# EAGLE schematic PCB-DISPARRAY4b (EAGLE 7.1.0)

## Sheet 1 of 2
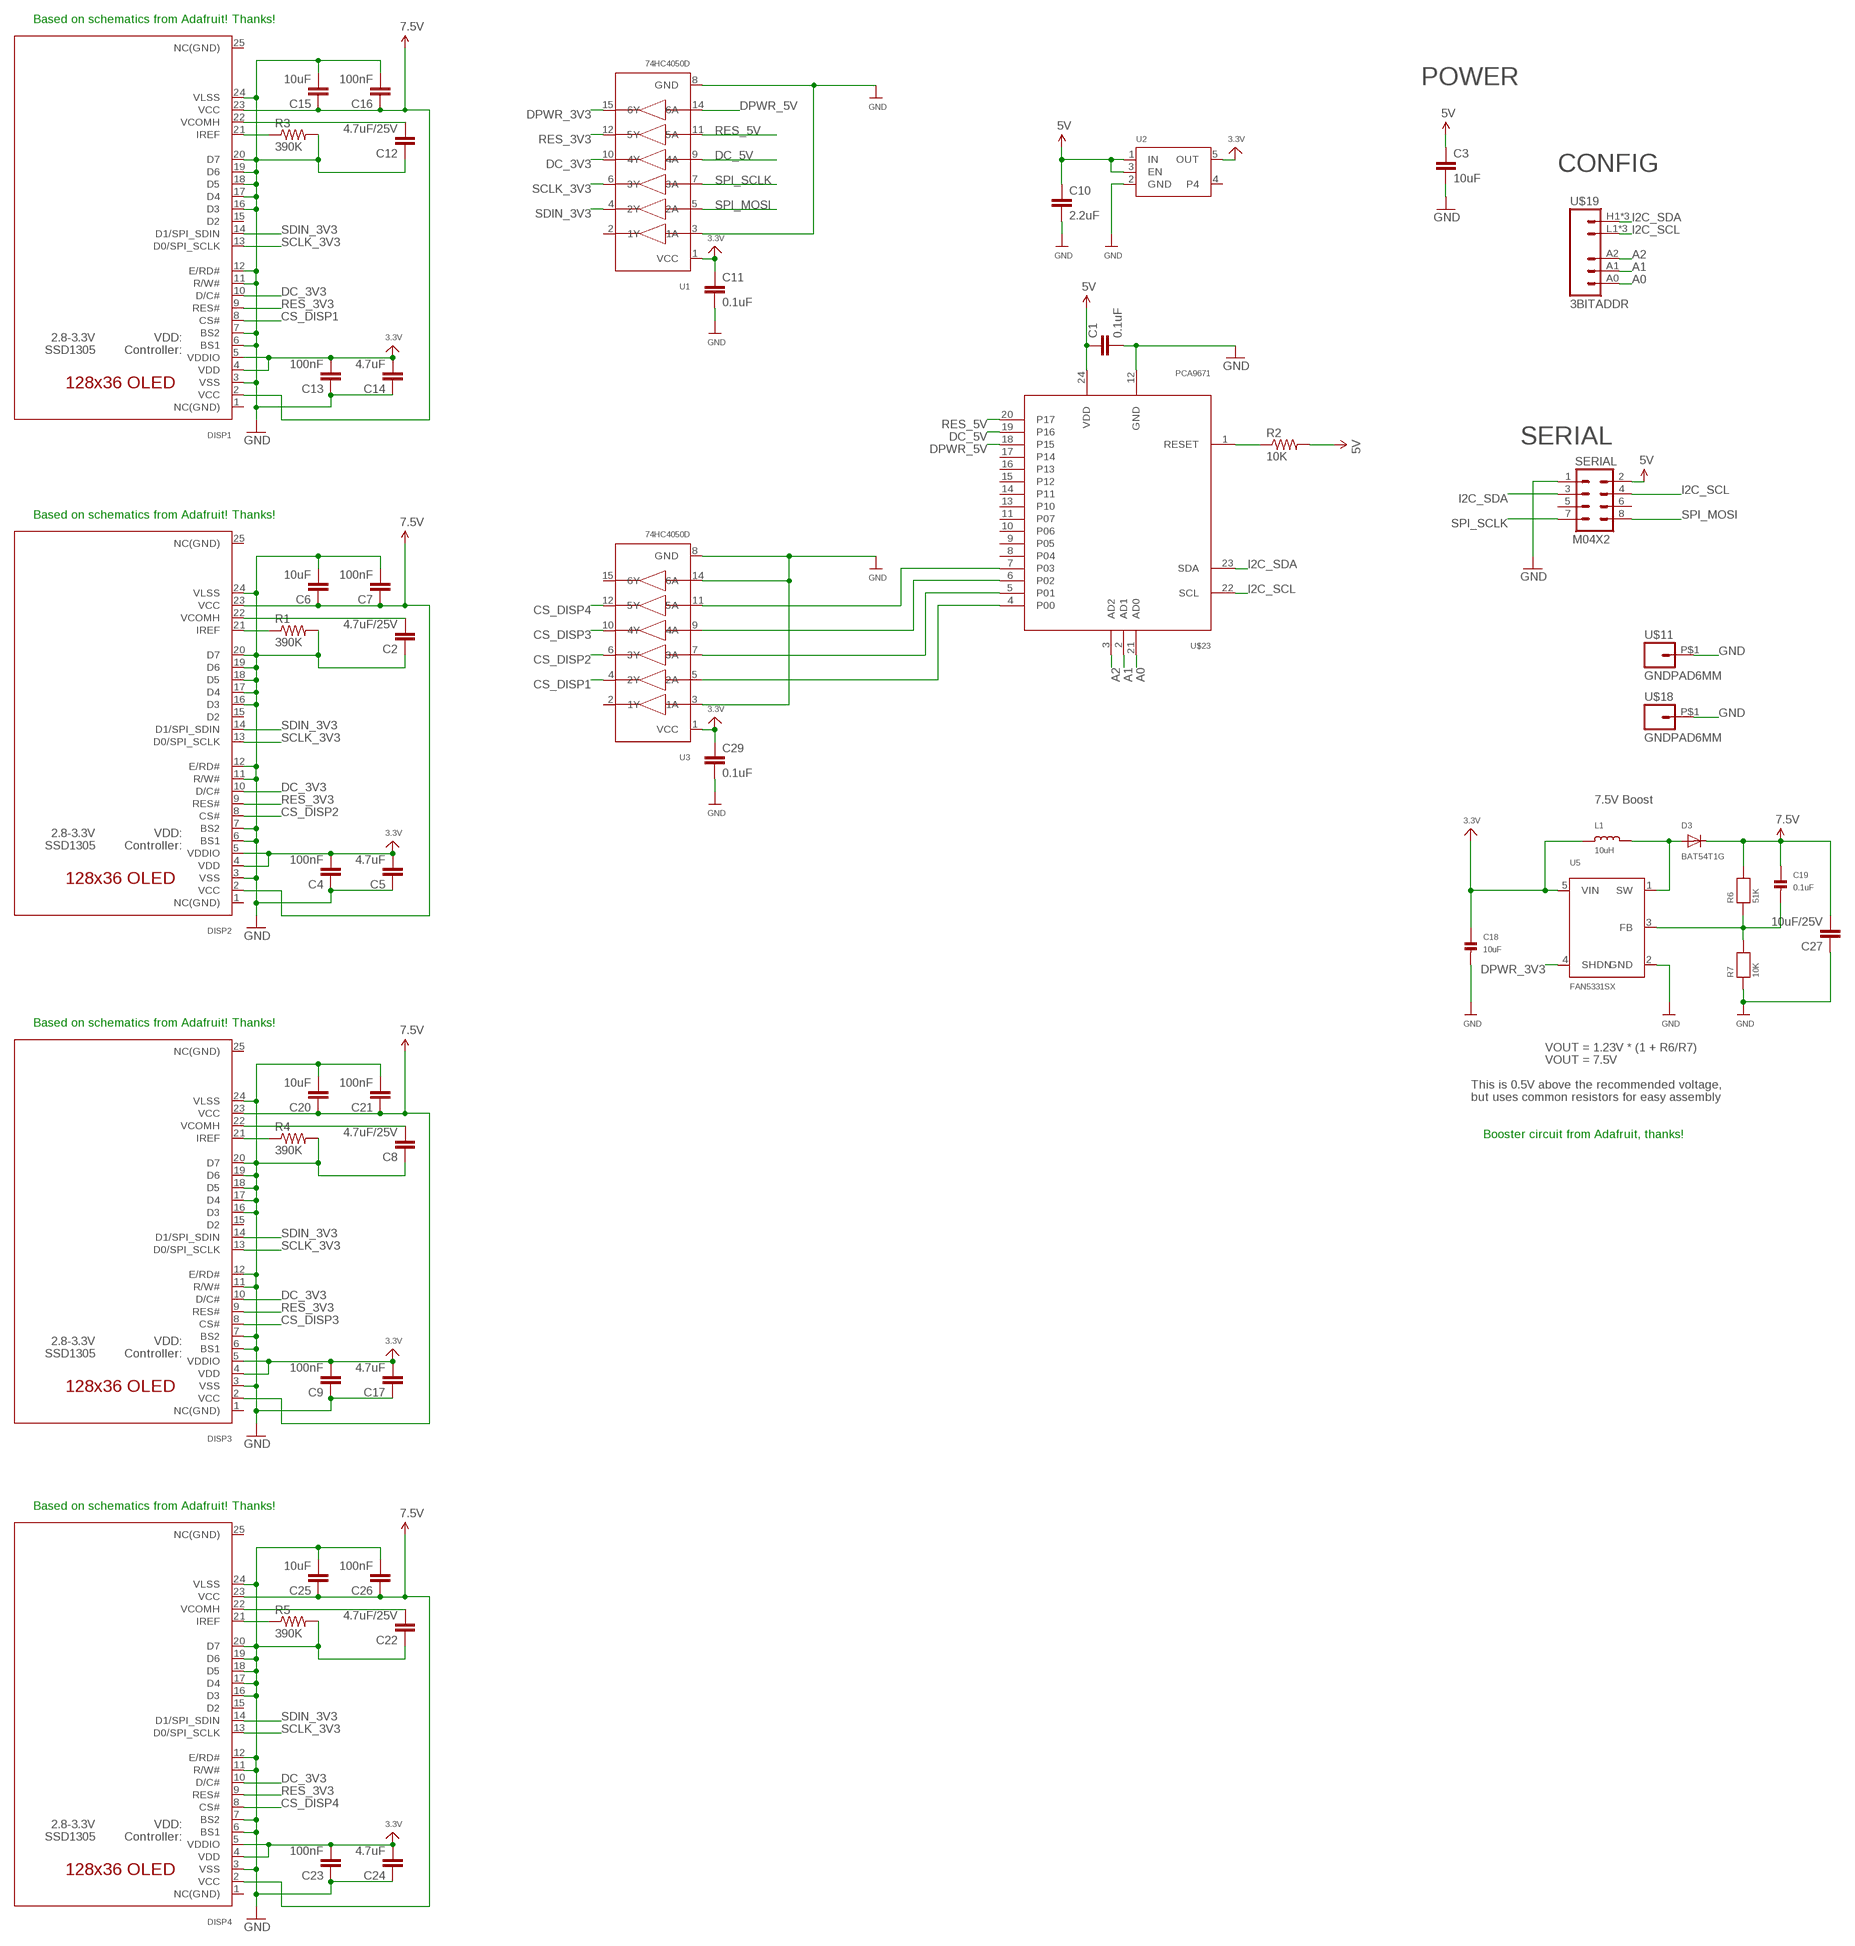
[diagram p0: schematic, sheet 1]

### Parts
C1  0.1uF  CAP0603-CAP  [0603-CAP]
C2  4.7uF/25V  CAP0805  [0805]
C3  10uF  CAP0805  [0805]
C4  100nF  CAP0603-CAP  [0603-CAP]
C5  4.7uF  CAP0603-CAP  [0603-CAP]
C6  10uF  CAP0805  [0805]
C7  100nF  CAP0603-CAP  [0603-CAP]
C8  4.7uF/25V  CAP0805  [0805]
C9  100nF  CAP0603-CAP  [0603-CAP]
C10  2.2uF  CAP0603-CAP  [0603-CAP]
C11  0.1uF  CAP0603-CAP  [0603-CAP]
C12  4.7uF/25V  CAP0805  [0805]
C13  100nF  CAP0603-CAP  [0603-CAP]
C14  4.7uF  CAP0603-CAP  [0603-CAP]
C15  10uF  CAP0805  [0805]
C16  100nF  CAP0603-CAP  [0603-CAP]
C17  4.7uF  CAP0603-CAP  [0603-CAP]
C18  10uF  CAP_CERAMIC0805  [0805]
C19  0.1uF  CAP_CERAMIC0603  [0603]
C20  10uF  CAP0805  [0805]
C21  100nF  CAP0603-CAP  [0603-CAP]
C22  4.7uF/25V  CAP0805  [0805]
C23  100nF  CAP0603-CAP  [0603-CAP]
C24  4.7uF  CAP0603-CAP  [0603-CAP]
C25  10uF  CAP0805  [0805]
C26  100nF  CAP0603-CAP  [0603-CAP]
C27  10uF/25V  CAP0805  [0805]
C29  0.1uF  CAP0603-CAP  [0603-CAP]
D3  BAT54T1G  DIODESOD-123  [SOD-123]
DISP1  ER-OLED011-1TOP  [ER-OLED011-1]
DISP2  ER-OLED011-1TOP  [ER-OLED011-1]
DISP3  ER-OLED011-1TOP  [ER-OLED011-1]
DISP4  ER-OLED011-1TOP  [ER-OLED011-1]
L1  10uH  INDUCTOR  [INDUCTOR_1007]
R1  390K  RESISTOR0603-RES  [0603-RES]
R2  10K  RESISTOR0603-RES  [0603-RES]
R3  390K  RESISTOR0603-RES  [0603-RES]
R4  390K  RESISTOR0603-RES  [0603-RES]
R5  390K  RESISTOR0603-RES  [0603-RES]
R6  51K  RESISTOR0603  [0603]
R7  10K  RESISTOR0603  [0603]
SERIAL  M04X2  [2X4]
U1  74HC4050D  74HC4050DTSSOP16  [TSSOP16]
U2  VREG_SOT23-5  [SOT23-5]
U3  74HC4050D  74HC4050DTSSOP16  [TSSOP16]
U5  FAN5331SX  FAN5331  [SOT23-5]
U$11  GNDPAD6MM  [3.2MMPAD6MM]
U$18  GNDPAD6MM  [3.2MMPAD6MM]
U$19  3BITADDR  [3BITADDR]
U$23  PCA9671  [TSSOP24]

### Nets
3.3V [Power]: C4.2 C5.2 C9.2 C11.1 C13.2 C14.2 C17.2 C18.1 C23.2 C24.2 C29.1 DISP1.4(VDD) DISP1.5(VDDIO) DISP2.4(VDD) DISP2.5(VDDIO) DISP3.4(VDD) DISP3.5(VDDIO) DISP4.4(VDD) DISP4.5(VDDIO) L1.P$1 U1.1(VCC) U2.5(OUT) U3.1(VCC) U5.5(VIN)
5V [Power]: C1.1 C3.1 C10.1 R2.2 SERIAL.2 U2.1(IN) U2.3(EN) U$23.24(VDD)
7.5V [Power]: C6.1 C7.1 C15.1 C16.1 C19.1 C20.1 C21.1 C25.1 C26.1 C27.2 D3.C DISP1.2(VCC) DISP1.23(VCC) DISP2.2(VCC) DISP2.23(VCC) DISP3.2(VCC) DISP3.23(VCC) DISP4.2(VCC) DISP4.23(VCC) R6.2
A0: U$19.A0 U$23.21(AD0)
A1: U$19.A1 U$23.2(AD1)
A2: U$19.A2 U$23.3(AD2)
CS_DISP1: DISP1.8(CS#) U3.4(2Y)
CS_DISP2: DISP2.8(CS#) U3.6(3Y)
CS_DISP3: DISP3.8(CS#) U3.10(4Y)
CS_DISP4: DISP4.8(CS#) U3.12(5Y)
DC_3V3: DISP1.10(D/C#) DISP2.10(D/C#) DISP3.10(D/C#) DISP4.10(D/C#) U1.10(4Y)
DC_5V: U1.9(4A) U$23.19(P16)
DPWR_3V3: U1.15(6Y) U5.4(SHDN)
DPWR_5V [Power]: U1.14(6A) U$23.18(P15)
GND [Power]: C1.2 C2.1 C3.2 C4.1 C5.1 C6.2 C7.2 C8.1 C9.1 C10.2 C11.2 C12.1 C13.1 C14.1 C15.2 C16.2 C17.1 C18.2 C20.2 C21.2 C22.1 C23.1 C24.1 C25.2 C26.2 C27.1 C29.2 DISP1.3(VSS) DISP1.6(BS1) DISP1.7(BS2) DISP1.11(R/W#) DISP1.12(E/RD#) DISP1.16(D3) DISP1.17(D4) DISP1.18(D5) DISP1.19(D6) DISP1.20(D7) DISP1.24(VLSS) DISP2.3(VSS) DISP2.6(BS1) DISP2.7(BS2) DISP2.11(R/W#) DISP2.12(E/RD#) DISP2.16(D3) DISP2.17(D4) DISP2.18(D5) DISP2.19(D6) DISP2.20(D7) DISP2.24(VLSS) DISP3.3(VSS) DISP3.6(BS1) DISP3.7(BS2) DISP3.11(R/W#) DISP3.12(E/RD#) DISP3.16(D3) DISP3.17(D4) DISP3.18(D5) DISP3.19(D6) DISP3.20(D7) DISP3.24(VLSS) DISP4.3(VSS) DISP4.6(BS1) DISP4.7(BS2) DISP4.11(R/W#) DISP4.12(E/RD#) DISP4.16(D3) DISP4.17(D4) DISP4.18(D5) DISP4.19(D6) DISP4.20(D7) DISP4.24(VLSS) R1.2 R3.2 R4.2 R5.2 R7.1 SERIAL.1 U1.3(1A) U1.8(GND) U2.2(GND) U3.3(1A) U3.8(GND) U3.14(6A) U5.2(GND) U$11.P$1 U$18.P$1 U$23.12(GND)
I2C_SCL: SERIAL.4 U$19.L1(GND) U$19.L2(GND) U$19.L3(GND) U$23.22(SCL)
I2C_SDA: SERIAL.3 U$19.H1(VCC) U$19.H2(VCC) U$19.H3(VCC) U$23.23(SDA)
N$1: R2.1 U$23.1(RESET)
N$2: DISP2.21(IREF) R1.1
N$3: C2.2 DISP2.22(VCOMH)
N$4: DISP3.21(IREF) R4.1
N$5: DISP1.21(IREF) R3.1
N$6: C8.2 DISP3.22(VCOMH)
N$7: DISP4.21(IREF) R5.1
N$8: C22.2 DISP4.22(VCOMH)
N$10: C12.2 DISP1.22(VCOMH)
N$14 [Power]: D3.A L1.P$2 U5.1(SW)
N$15: C19.2 R6.1 R7.2 U5.3(FB)
N$29: U3.5(2A) U$23.4(P00)
N$30: U3.7(3A) U$23.5(P01)
N$31: U3.9(4A) U$23.6(P02)
N$32: U3.11(5A) U$23.7(P03)
RES_3V3: DISP1.9(RES#) DISP2.9(RES#) DISP3.9(RES#) DISP4.9(RES#) U1.12(5Y)
RES_5V: U1.11(5A) U$23.20(P17)
SCLK_3V3: DISP1.13(D0/SPI_SCLK) DISP2.13(D0/SPI_SCLK) DISP3.13(D0/SPI_SCLK) DISP4.13(D0/SPI_SCLK) U1.6(3Y)
SDIN_3V3: DISP1.14(D1/SPI_SDIN) DISP2.14(D1/SPI_SDIN) DISP3.14(D1/SPI_SDIN) DISP4.14(D1/SPI_SDIN) U1.4(2Y)
SPI_MOSI: SERIAL.8 U1.5(2A)
SPI_SCLK: SERIAL.7 U1.7(3A)
Unconnected: DISP1.1(NC(GND)) DISP1.15(D2) DISP1.25(NC(GND)) DISP2.1(NC(GND)) DISP2.15(D2) DISP2.25(NC(GND)) DISP3.1(NC(GND)) DISP3.15(D2) DISP3.25(NC(GND)) DISP4.1(NC(GND)) DISP4.15(D2) DISP4.25(NC(GND)) SERIAL.5 SERIAL.6 U1.2(1Y) U2.4 U3.2(1Y) U3.15(6Y) U$23.8(P04) U$23.9(P05) U$23.10(P06) U$23.11(P07) U$23.13(P10) U$23.14(P11) U$23.15(P12) U$23.16(P13) U$23.17(P14)

### Notes on the sheet
- Based on schematics from Adafruit! Thanks!
- POWER
- CONFIG
- SERIAL
- Based on schematics from Adafruit! Thanks!
- 7.5V Boost
- Based on schematics from Adafruit! Thanks!
- VOUT = 1.23V * (1 + R6/R7)
- VOUT = 7.5V
- This is 0.5V above the recommended voltage,
- but uses common resistors for easy assembly
- Booster circuit from Adafruit, thanks!
- Based on schematics from Adafruit! Thanks!

## Sheet 2 of 2

## Library data of the parts
C1-C17 C20-C27 C29 = SparkFun:CAP: Capacitor Standard 0603 ceramic capacitor, and 0.1" leaded capacitor.
C18 C19 = microbuilder:CAP_CERAMIC: Ceramic Capacitors 0402 - 0402 Surface Mount Capacitors 16pF 50V 5% [Digikey: 445-4899-2-ND] 18pF 50V 5% [Digikey: 490-1281-2-ND] 22pF 50V 5% [Digikey: 490-1283-2-ND] 68pF 50V 5% [Digikey: 490-1289-2-ND] 0.1uF 10V 10% [Digikey: 490-1318-2-ND] 1.0uF 6.3V 10% [Digikey: 490-1320-2-ND] 0603 - 0603 Surface Mount Capacitors 16 pF 50V 5% [Digikey: 445-5051-2-ND] 22 pF 50V [Digikey: PCC220ACVTR-ND] 33 pF 50V 5% [Digikey: 490-1415-1-ND] 56pF 50V 5% [Digikey: 490-1421-1-ND] 220pF 50V 5% [Digikey: 445-1285-1-ND] 680 pF 50V 2200 pF 50V 5% C0G [Digikey: 445-1297-1-ND] 5600 pF 100V 5% X7R [Digikey: 478-3711-1-ND] 0.1 µF 25V 10% [Digikey: PCC2277TR-ND] 0.22 µF 16V 10% X7R [Digikey: 445-1318-1-ND] 1.0 µF 25V 10% [Digikey: 445-5146-2-ND] 0603 - RF Specific 3pF 250V +/-0.1pF RF [Digikey: 712-1347-1-ND] 18 pF 250V 5% [Digikey: 478-3505-1-ND or 712-1322-1-ND] 56 pF 250V 5% C0G RF [Digikey: 490-4867-1-ND] 68 pF 250V RF [Digikey: 490-4868-1-ND] 0805 - 0805 Surface Mount Capacitors 220 pF 250V 2% RF Ceramic Capacitor [Digikey: 712-1398-1-ND] 1000 pF 50V 2% NP0 Ceramic Capacitor [Digikey: 478-3760-1-ND] 0.1 µF 25V 10% Ceramic Capacitor [Digikey: PCC1828TR-ND] 1.0 µF 16V 10% Ceramic Capacitor[Digikey: 490-1691-2-ND] 10.0 µF 10V 10% Ceramic Capacitor[Digikey: 709-1228-1-ND] 10.0 uF 16V 10% Ceramic Capacitor [Digikey: 478-5165-2-ND] 47 uF 6.3V 20% Ceramic Capacitor [Digikey: 587-1779-1-ND or 399-5506-1-ND] 1206 - 1206 Surface Mount Capacitors 47uF 10V 20% Ceramic Capacitor [Digikey: 490-5528-1-ND or 399-5508-1-ND or 445-6010-1-ND] 100uF 6.3V -20%, +80% Y5V Ceramic Capacitor (Digikey: 490-4512-1-ND, Mouser: 81-GRM31CF50J107ZE1L)
D3 = microbuilder:DIODE: Diode SMA Model Volts Amps Type Vf Vr Digikey # Notes SSA34-E3 40V 3A Schottky 480mV @ 3A 200uA @ 40V SSA34-E3/61TGITR-ND CDBA120-G 20V 1A Schottky 500mV @ 1A 500uA @ 20V 641-1014-6-ND REEL MBRA210 10V 2A Schottky 350mV @ 2A 700uA @ 10V MBRA210LT3 SOD-123 Model Volts Amps Type Vf Vr Order # Notes BAT54T1G 30V 200mA Schottky 800mV @ 200mA 2uA @ 25V BAT54T1GOSTR-ND B0530W 30V 500mA Schottky 430mV @ 500mA 130uA @ 30V B0530W-FDICT-ND REEL MBR120 1A 20V Schottky 340mV @ 1A MBR120VLSFT1GOSCT-ND SOD-323 Model Volts Amps Type Vf Vr Order # Notes PMEG2005EJ 20V 500mA Schottky 355mV @ 500mA 568-4110-1-ND ZLLS410 10V 570mA Schottky 380mV @ 570mA ZLLS410CT-ND 1N4148WS 75V 150mA Silicon/Simple 1V 1N4148WSFSCT-ND REEL SOD-523 Model Volts Amps Type Vf Vr Order # Notes BAT54XV2 30V 200mA Schottky 0.8V @ 100mA BAT54XV2CT-ND TB751S 30V 30mA Schottky RB751S-40TE61CT-ND SOT23-R/W (R = Solder Paste/Reflow Ovens, W = Hand-Soldering) Model Volts Amps Type Vf Vr Order # Notes BAT54FILM 40V 300mA Schottky 497-7162-1-ND
DISP1-DISP4 = SKAARHOJ:ER-OLED011-1: UG-2864HSWEG01 OLED display Both 1.3" and 0.96" models share the same FPC tab footprint, only the screen dimensions vary.
L1 = microbuilder:INDUCTOR: Inductors 0603: 10nH Ceramic Inductor - microwire antenna/RF (Digikey: 712-1434-2-ND) 0805: 560nH Ceramic Inductor - RF (Digikey: 553-1047-1-ND) 270nH Ceramic Inductor - Q = 40@250MHz, +-5%, 1 Ohm DC Resistance (Digikey: 535-10506-2-ND) 1007 (2518 Metric) SMT: 10µH 10% 250mOhm 820mA 1007 Inductor (Digikey: 587-2189-1-ND) 22µH 10% 500mOhm 580mA 1007 Inductor (Digikey: 587-2190-1-ND) 47µH 10% 950mOhm 420mA 1007 Inductor (Digikey: 587-2191-1-ND) 47µH 5% 100mOhm 1A 1008 Inductor (Digikey: 732-1816-1-ND) 5.0x5.0mm (Taiyo Yuden NR5040 Series) 6.8µH 20% 2.3A 64mOhm Inductor (Digikey: 587-2374-2-ND) 5.0x5.0mm (TDK VLC5045 Series) 4.7µH 20% 3.3A 34mOhm Inductor (Digikey: 445-6526-1-ND) 6.8µH 20% 2.7A 46mOhm Inductor (Digikey: 445-6527-1-ND) 6.0x6.0mm (TDK VLC6045 Series) 4.7µH 20% 3.8A 27mOhm Inductor (Digikey: 445-6538-2-ND) 6.8µH 20% 3A 41mOhm Inductor (Digikey: 445-6540-1-ND) 6.2µH 30% 2.2A 45mOhm Inductor (Digikey: SRR5028-6R2YCT-ND) - Not TDK VLC6045 but footprint should match 6.0x6.0mm (TDK SLF6045 Series) 6.8uH 30% 2A 33mOhm Inductor (Digikey: 445-4572-1-ND, Mouser: 810-SLF645T6R8N2R0PF)
R1-R5 = SparkFun:RESISTOR: Resistor Basic schematic elements and footprints for 0603, 1206, and PTH resistors.
R6 R7 = microbuilder:RESISTOR: Resistors 0402 - 0402 Surface Mount Package 22 Ohm 1% 1/16W [Digikey: 311-22.0LRTR-ND] 33 Ohm 5% 1/16W 1.0K 5% 1/16W 1.5K 5% 1/16W 2.0K 1% 1/16W 10.0K 1% 1/16W [Digikey: 311-10.0KLRTR-ND] 10.0K 5% 1/16W [Digikey: RMCF0402JT10K0TR-ND] 12.1K 1% 1/16W [Digikey: 311-22.0LRTR-ND] 100.0K 5% 1/16W 0603 - 0603 Surface Mount Package 0 Ohm 1/10 Watt 1% Resistor 15 Ohm 1/10 Watt 1% Resistor 33 Ohm 1/10 Watt 1% Resistor 49.9 Ohm 1/10 Watt 1% Resistor 100 Ohm 1/10 Watt 1% Resistor 150 Ohm 1/10 Watt 1% Resistor 240 Ohm 1/10 Watt 1% Resistor 390 Ohm 1/10 Watt 1% Resistor 560 Ohm 1/10 Watt 1% Resistor 680 Ohm 1/10 Watt 1% Resistor 750 Ohm 1/10 Watt 1% Resistor 1.0K Ohm 1/10 Watt 1% Resistor 1.5K Ohm 1/10 Watt 1% Resistor 2.0K Ohm 1/10 Watt 1% Resistor 2.2K Ohm 1/10 Watt 1% Resistor 3.3K Ohm 1/10 Watt 1% Resistor 4.7K Ohm 1/10 Watt 1% Resistor 10.0K Ohm 1/10 Watt 1% Resistor 12.0K Ohm 1/10 Watt 1% Resistor 12.1K Ohm 1/10 Watt 1% Resistor 20.0K Ohm 1/10 Watt 1% Resistor 33.0K Ohm 1/10 Watt 1% Resistor 100.0K Ohm 1/10 Watt 1% Resistor 0805 - 0805 Surface Mount Package 0 Ohm 1/8 Watt 1% Resistor 33 Ohm 1/8 Watt 1% Resistor 100 Ohm 1/8 Watt 1% Resistor 150 Ohm 1/8 Watt 1% Resistor 200 Ohm 1/8 Watt 1% Resistor 240 Ohm 1/8 Watt 1% Resistor 330 Ohm 1/8 Watt 1% Resistor 390 Ohm 1/8 Watt 1% Resistor 470 Ohm 1/8 Watt 1% Resistor 1.0K Ohm 1/8 Watt 1% Resistor 1.5K Ohm 1/8 Watt 1% Resistor 2.0K Ohm 1/8 Watt 1% Resistor 4.7K Ohm 1/8 Watt 1% Resistor 5.1K Ohm 1/8 Watt 1% Resistor 5.6K Ohm 1/8 Watt 1% Resistor 10.0K Ohm 1/8 Watt 1% Resistor 22.0K Ohm 1/8 Watt 1% Resistor 33.0K Ohm 1/8 Watt 1% Resistor 100K Ohm 1/8 Watt 1% Resistor 1206 - 1206 Surface Mount Package 2012 - 2010 Surface Mount Package 0.11 Ohm 1/2 Watt 1% Resistor - Digikey: RHM.11UCT-ND
SERIAL = SparkFun:M04X2
U1 U3 = SKAARHOJ:74HC4050D: 6-channel level shifter 74HC4050D - 2V-6V Supply Digikey: 74HC4050D,653-ND Mouser: 771-74HC4050D-T
U2 = microbuilder:VREG_SOT23-5: SOT23-5 Fixed Voltage Regulators To better organise some of the SOT23-5 fixed voltage regulators in this library, this new part was created. Part Current Out V Out V In V Dropout Digikey Part No. ADP121 150mA 3.3V 3.4-5.5V 0.09V @ 150mA ADP121-AUJZ33R7CT-ND ADP121 150mA 3.0V 3.1-5.5V 0.09V @ 150mA ADP121-AUJZ30R7CT-ND ADP122 300mA 3.3V 3.4-5.5V 0.085V @ 300mA ADP122AUJZ-3.3-R7CT-ND ADP1712 300mA 3.3V 3.5-5.5V 0.17V @ 300mA ADP1712AUJZ-3.3-R7TR-ND AP7311 (Low Cost) 150mA 3.3V 3.5-6V 0.15V @ 150mA AP7311-33WG-7DICT-ND LD39015M18R 150mA 1.8V 1.9V-5.5V 0.08V @ 100mA 497-6977-1-ND MCP1824T-3302E/OT 300mA 3.3V 3.5V-6V 0.2V @ 300mA MCP1824T-3302E/OTCT-ND MIC5205-2.5YM5 TR 150mA 2.5V 2.7-16V 0.165V @ 150mA 576-1257-2-ND MIC5205-3.0YM5 TR 150mA 3.0V 3.2V-16V 0.165V @ 150mA 576-1258-2-ND MIC5205-3.3YM5 TR 150mA 3.3V 3.5V-16V 0.165V @ 150mA 576-1259-2-ND TPS780330220 150mA 3.3V+2.2V 3.6-5.5V 250mV Max 296-23332-1-ND TDA3663/N1,135 100mA 3.3V 3.5-45V 0.18V @ 50mA 568-5343-1-ND
U5 = microbuilder:FAN5331: FAN5331 - LED/OLED 20V Boost Converter Digikey: FAN5331SXCT-ND
U$11 U$18 = SKAARHOJ:GNDPAD
U$19 = SKAARHOJ:3BITADDR
U$23 = SKAARHOJ:PCA9671

## Net classes
0 default: width 0.203 mm, drill 0.305 mm, clearance 0.203 mm
1 Power: width 0.305 mm, drill 0.406 mm, clearance 0.203 mm